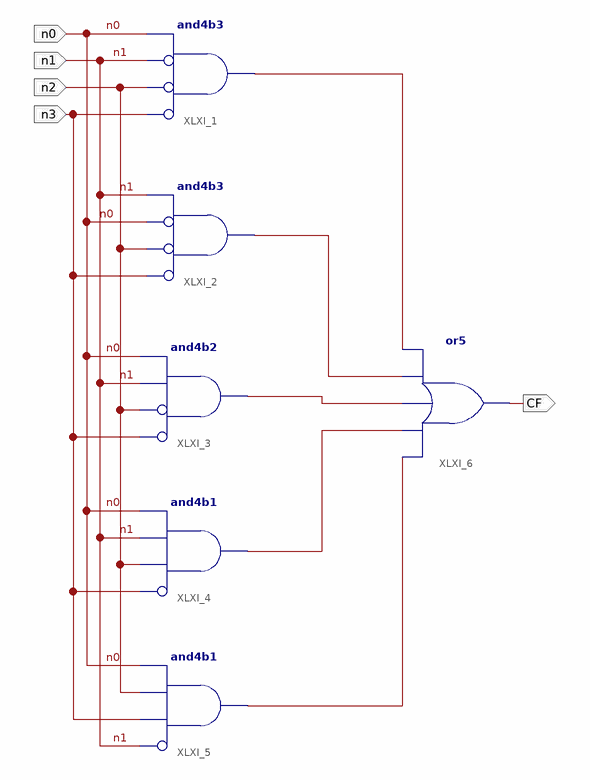
[diagram p0: schematic sheet 1]
// Xilinx ISE schematic F.sch (spartan3e) as structural Verilog: 6 symbols, 5 ports
module F (
  input  n0,
  input  n1,
  input  n2,
  input  n3,
  output CF
);

  wire XLXN_5, XLXN_6, XLXN_7, XLXN_8, XLXN_9;

  and XLXI_1 (XLXN_5, ~n3, ~n2, ~n1, n0);  // and4b3
  and XLXI_2 (XLXN_6, ~n3, ~n2, ~n0, n1);  // and4b3
  and XLXI_3 (XLXN_7, ~n3, ~n2, n1, n0);  // and4b2
  and XLXI_4 (XLXN_8, ~n3, n2, n1, n0);  // and4b1
  and XLXI_5 (XLXN_9, ~n1, n3, n2, n0);  // and4b1
  or XLXI_6 (CF, XLXN_9, XLXN_8, XLXN_7, XLXN_6, XLXN_5);
endmodule
